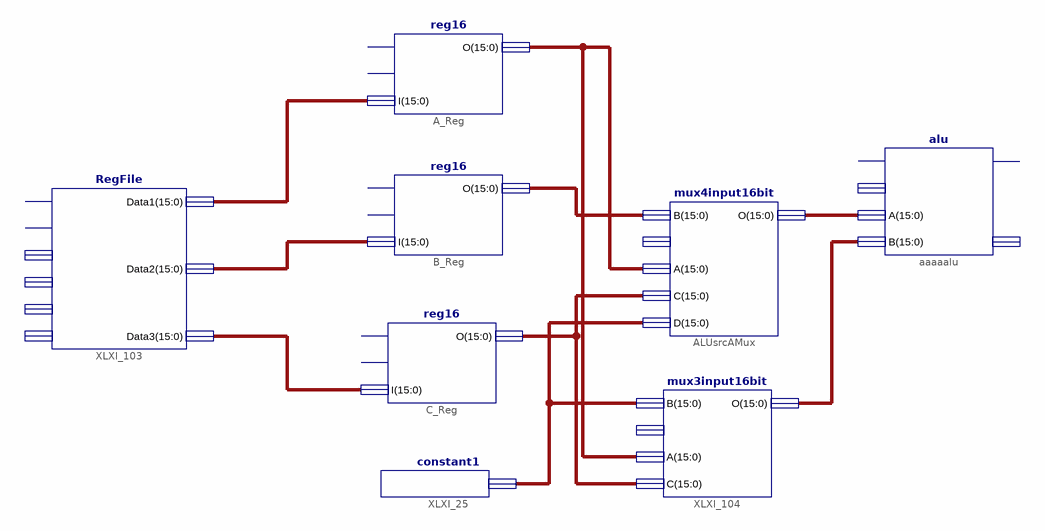
[diagram p0: schematic sheet 1]
// Xilinx ISE schematic RegALU.sch (spartan3adsp) as structural Verilog: 8 symbols, 0 ports
module RegALU (
);

  wire [15:0] XLXN_1, XLXN_3, XLXN_100, XLXN_276, XLXN_277, XLXN_278, XLXN_279, XLXN_280, XLXN_281;

  mux4input16bit ALUsrcAMux (.B(XLXN_281), .A(XLXN_280), .C(XLXN_279), .D(XLXN_100), .O(XLXN_3));  // open: S
  alu aaaaalu (.A(XLXN_3), .B(XLXN_1));  // open: Flip, ALUct1, Zero, ALUOut
  reg16 A_Reg (.I(XLXN_278), .O(XLXN_280));  // open: CLK, Write
  reg16 C_Reg (.I(XLXN_276), .O(XLXN_279));  // open: CLK, Write
  reg16 B_Reg (.I(XLXN_277), .O(XLXN_281));  // open: CLK, Write
  constant1 XLXI_25 (.O(XLXN_100));
  RegFile XLXI_103 (
    .Data1(XLXN_278), .Data2(XLXN_277), .Data3(XLXN_276));  // open: RegWrite, clock, Read1, Read2, WriteReg, WriteData
  mux3input16bit XLXI_104 (.B(XLXN_100), .A(XLXN_280), .C(XLXN_279), .O(XLXN_1));  // open: S
endmodule
